# Altium schematic sheet [09] - AFE.SchDoc (part 3 of 3)
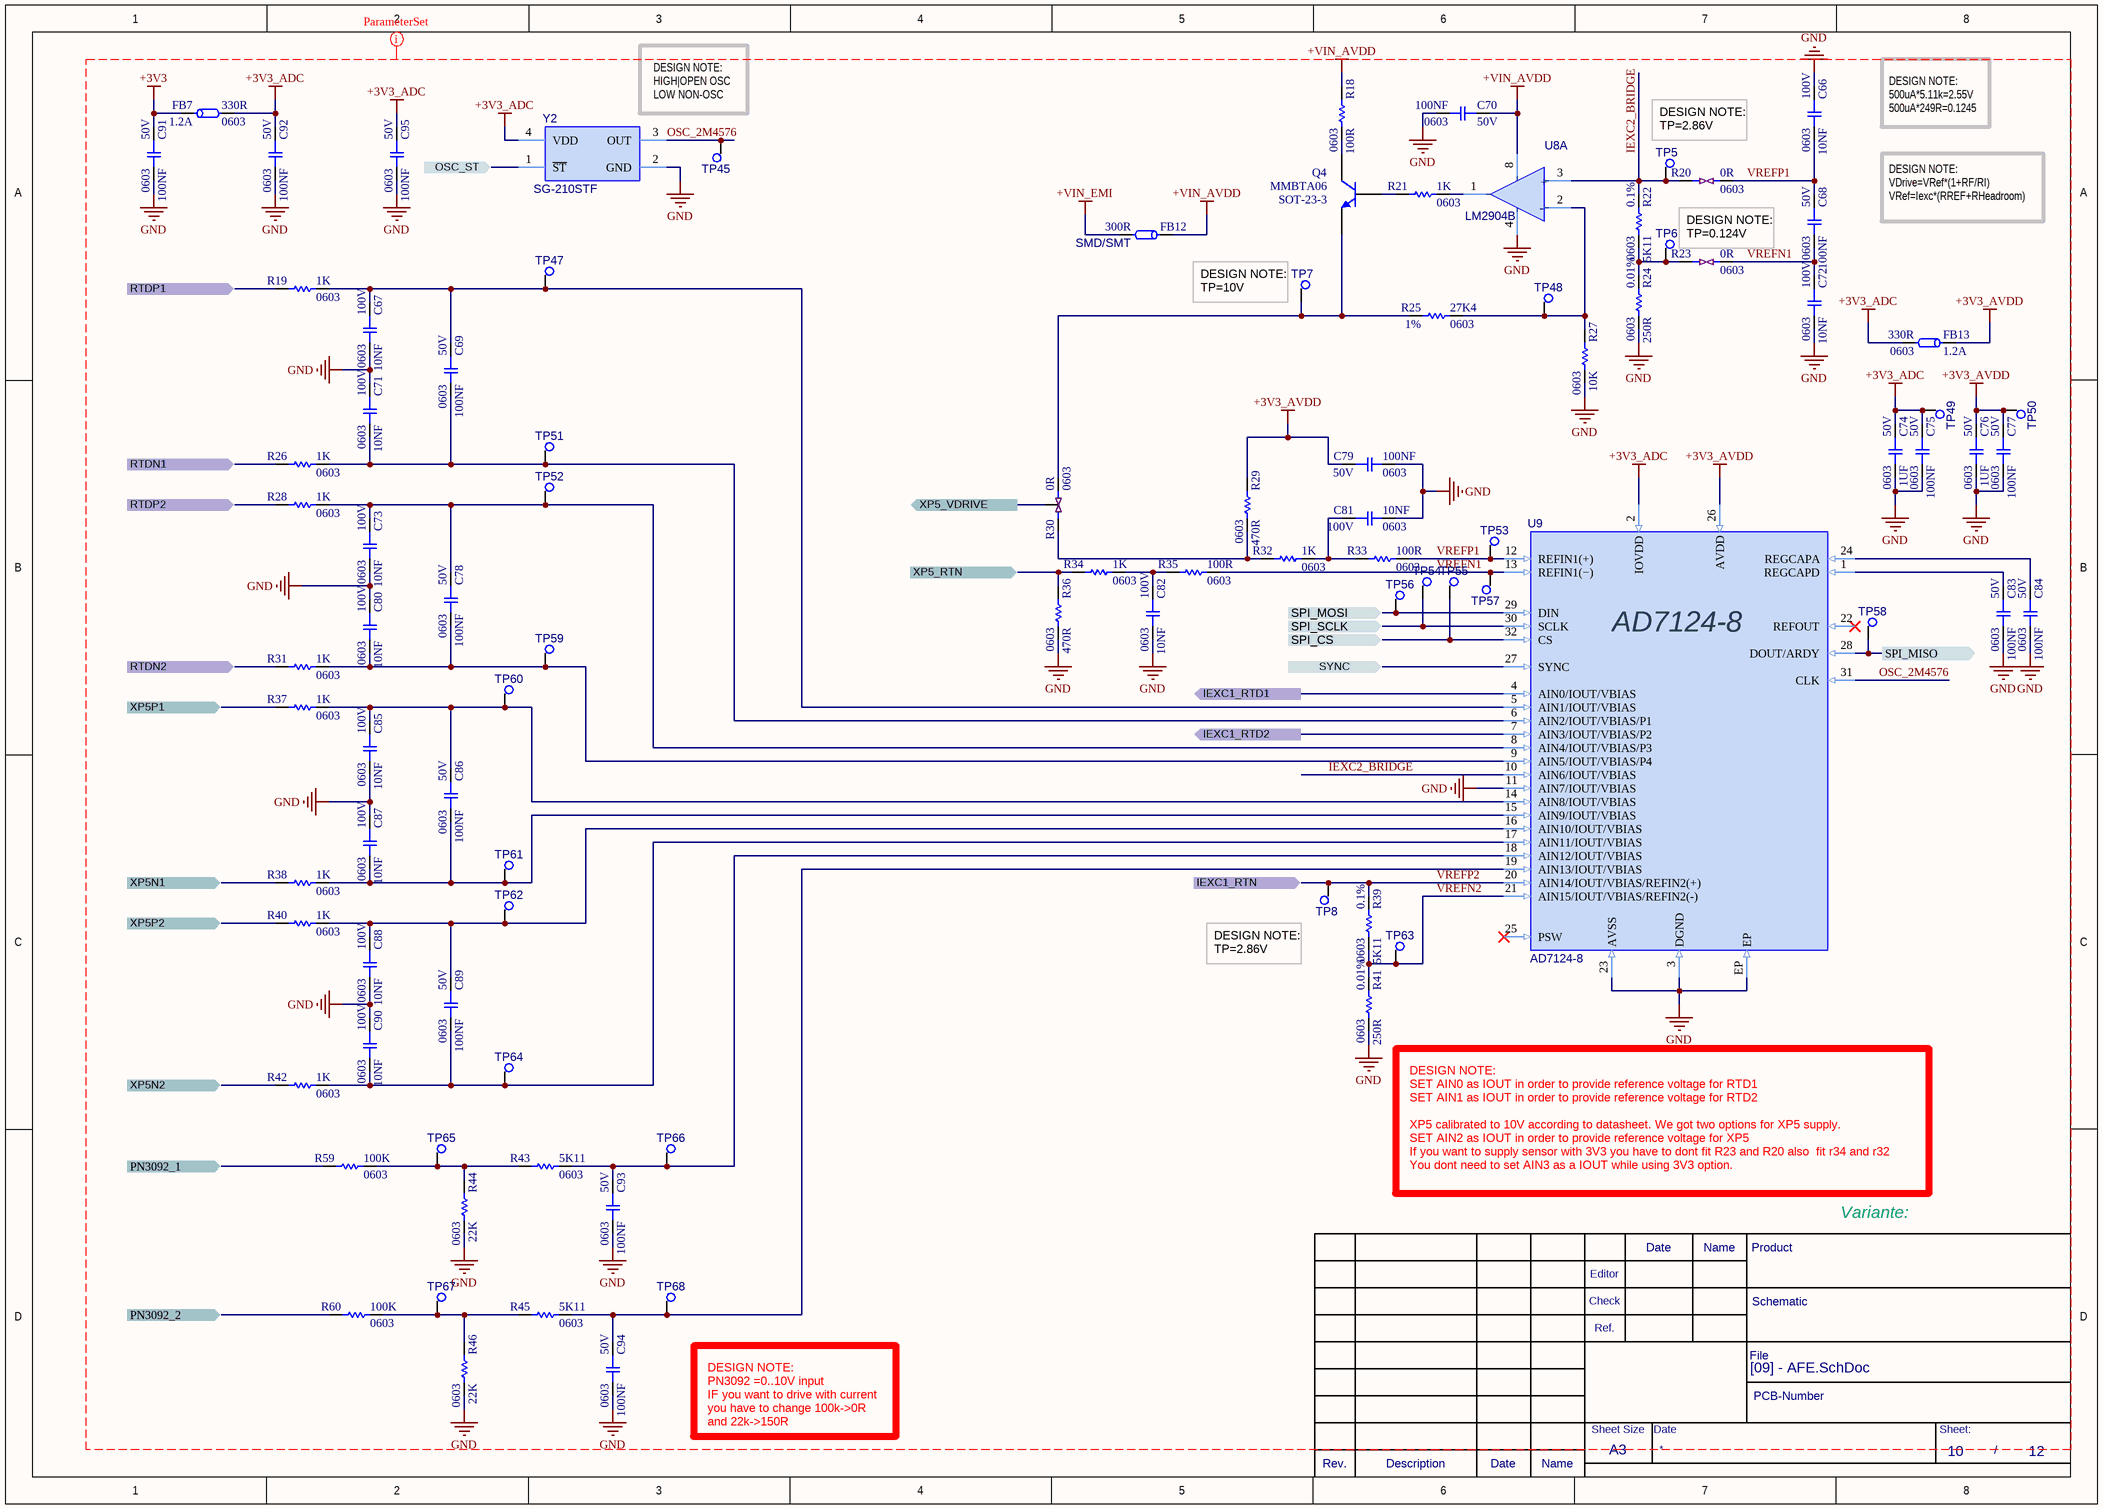
[diagram p2: [09] - AFE.SchDoc]

## Library data of the parts (continued)
R59 R60 = R-100K-0603: RES SMD 100K OHM 5% 1/10W 0603; Manufacturer: YAGEO; Manufacturer Part Number: RC0603JR-10100KL; Resistance: 100kR; Temperature Coefficient: 100ppm/°C; Power Rating: 100mW; Voltage Rating: 50V; Working Voltage: 75V; Number of Resistors: 1; .PCBCHK: USED; .Creator: F:TALI; Washability: OK; Supplier 1: Digi-Key; Supplier Part Number 1: YAG2294DKR-ND; Stock 1: 0; Pricing 1: 1=0.1, 10=0.022, 100=0.0088, 1000=0.00396, 2500=0.00344, 5000=0.00284 (USD); Case/Package: 0603; Number of Pins: 2; Contact Plating: Matte,Tin; Case Code (Metric): 1608; Min Operating Temperature: -55°C; Max Operating Temperature: 155°C; Tolerance: 5%; Composition: Thick Film; Packaging: Tape and Reel; Number of Terminations: 2; Termination: SMD/SMT; Package Quantity: 10000; Military Standard: Not; Max Power Dissipation: 100mW; Voltage Rating (DC): 50V; Features: Moisture Resistant; Length: 1.6mm; Height: 0.022inch; Width: 0.031inch; Depth: 0.8mm; Radiation Hardening: No; REACH SVHC: No SVHC; ComponentLink1URL: http://www.mouser.com/ds/2/447/RC0603-272842.pdf; ComponentLink1Description: http://www.mouser.com/ds/2/447/RC0603-272842.pdf; ComponentLink2URL: https://www.verical.com/server-webapp/html/getDatasheet?partID=326545; ComponentLink2Description: https://www.verical.com/server-webapp/html/getDatasheet?partID=326545; Lead Free: Lead Free; ComponentLink3URL: http://www.farnell.com/datasheets/2167052.pdf; ComponentLink3Description: http://www.farnell.com/datasheets/2167052.pdf; ComponentLink4URL: http://www.farnell.com/datasheets/1868787.pdf; ComponentLink4Description: http://www.farnell.com/datasheets/1868787.pdf; ComponentLink5URL: http://www.farnell.com/datasheets/1738695.pdf; ComponentLink5Description: http://www.farnell.com/datasheets/1738695.pdf; ComponentLink6URL: http://documents.rs-components.com/techlib://itc_doclist_GB.htm?stockno=5048940; ComponentLink6Description: http://documents.rs-components.com/techlib://itc_doclist_GB.htm?stockno=5048940; ComponentLink7URL: http://www.farnell.com/datasheets/443971.pdf; ComponentLink7Description: http://www.farnell.com/datasheets/443971.pdf; Mount: Surface Mount; Weight: 7.1E-05oz; ComponentLink8URL: http://industrial.panasonic.com/www-data/pdf/AOA0000/AOA0000CE2.pdf; ComponentLink8Description: http://industrial.panasonic.com/www-data/pdf/AOA0000/AOA0000CE2.pdf; ComponentLink9URL: https://www.verical.com/server-webapp/html/getDatasheet?partID=247527; ComponentLink9Description: https://www.verical.com/server-webapp/html/getDatasheet?partID=247527; ComponentLink10URL: http://www.alliedelec.com/m/d/623f45ff1957d936ff56d46fd1c28cac.pdf; ComponentLink10Description: http://www.alliedelec.com/m/d/623f45ff1957d936ff56d46fd1c28cac.pdf; ComponentLink11URL: http://www.jameco.com/Jameco/Products/ProdDS/1987476.pdf; ComponentLink11Description: http://www.jameco.com/Jameco/Products/ProdDS/1987476.pdf; Supplier 2: Digi-Key; Supplier Part Number 2: 1276-5110-2-ND; Stock 2: 0; Pricing 2: 5000=0.0033, 10000=0.00287, 25000=0.00252, 50000=0.00231, 125000=0.00229 (USD); ComponentLink12URL: http://www1.futureelectronics.com/doc/SAMSUNG/RCSERIES.pdf; ComponentLink12Description: http://www1.futureelectronics.com/doc/SAMSUNG/RCSERIES.pdf; Failure Rate: 0.01%; ComponentLink13URL: http://www.vishay.com/docs/31010/rcwpm.pdf; ComponentLink13Description: http://www.vishay.com/docs/31010/rcwpm.pdf; ComponentLink14URL: http://www.yageo.com/documents/recent/PYu-RC_Group_51_RoHS_L_9.pdf; ComponentLink14Description: http://www.yageo.com/documents/recent/PYu-RC_Group_51_RoHS_L_9.pdf; ComponentLink15URL: https://www.verical.com/server-webapp/html/getDatasheet?partID=327958; ComponentLink15Description: https://www.verical.com/server-webapp/html/getDatasheet?partID=327958; ComponentLink16URL: http://www.yageo.com/documents/recent/PYu-RC_Group_51_RoHS_L_2.pdf; ComponentLink16Description: http://www.yageo.com/documents/recent/PYu-RC_Group_51_RoHS_L_2.pdf; ComponentLink17URL: http://www.yageo.com/NewPortal/yageodocoutput?fileName=/pdf/R-Chip/PYu-RT_1-to-0.05_RoHS_L_5.pdf; ComponentLink17Description: http://www.yageo.com/NewPortal/yageodocoutput?fileName=/pdf/R-Chip/PYu-RT_1-to-0.05_RoHS_L_5.pdf; Lead Pitch: 0.4mm; ComponentLink18URL: http://documents.rs-components.com/techlib://itc_doclist_GB.htm?stockno=6185113; ComponentLink18Description: http://documents.rs-components.com/techlib://itc_doclist_GB.htm?stockno=6185113; ComponentLink19URL: http://www.yageo.ru/pdf/RC0805.pdf; ComponentLink19Description: http://www.yageo.ru/pdf/RC0805.pdf; ComponentLink20URL: http://www.farnell.com/datasheets/38627.pdf; ComponentLink20Description: http://www.farnell.com/datasheets/38627.pdf; ComponentLink21URL: http://www.farnell.com/datasheets/1697719.pdf; ComponentLink21Description: http://www.farnell.com/datasheets/1697719.pdf; ComponentLink22URL: http://www.farnell.com/datasheets/1686128.pdf; ComponentLink22Description: http://www.farnell.com/datasheets/1686128.pdf; ComponentLink23URL: http://www.farnell.com/datasheets/444164.pdf; ComponentLink23Description: http://www.farnell.com/datasheets/444164.pdf; Supplier 3: Digi-Key; Supplier Part Number 3: A106046DKR-ND; Stock 3: 219997; Pricing 3: 1=0.1, 10=0.026, 100=0.0104, 1000=0.00469, 2500=0.00407 (USD); ELV: Compliant; ComponentLink24URL: http://www.alliedelec.com/m/d/dd92310293d361ca5b4f9a8a31ebf2ac.pdf; ComponentLink24Description: http://www.alliedelec.com/m/d/dd92310293d361ca5b4f9a8a31ebf2ac.pdf; ComponentLink25URL: http://www.mouser.com/ds/2/418/NG_CD_1622827_BA-655491.pdf; ComponentLink25Description: http://www.mouser.com/ds/2/418/NG_CD_1622827_BA-655491.pdf; ComponentLink26URL: http://uk.rs-online.com/webdocs/13d1/0900766b813d116f.pdf; ComponentLink26Description: http://uk.rs-online.com/webdocs/13d1/0900766b813d116f.pdf; Supplier 4: Digi-Key; Supplier Part Number 4: P100KHCT-ND; Stock 4: 9351077; Pricing 4: 1=0.1, 10=0.065, 100=0.0264, 1000=0.01186, 2500=0.01029 (USD); Supplier 5: Digi-Key; Supplier Part Number 5: P20200DKR-ND; Stock 5: 0; Pricing 5: 1=0.25, 10=0.211, 25=0.1532, 50=0.111, 100=0.0823, 250=0.06316, 500=0.04976, 1000=0.03445 (USD); Height - Seated (Max): 0.022inch; Supplier 6: Digi-Key; Supplier Part Number 6: RMCF0603JT100KDKR-ND; Stock 6: 227219; Pricing 6: 1=0.1, 10=0.016, 100=0.0064, 1000=0.00289, 2500=0.0025 (USD); ComponentLink27URL: https://www.verical.com/server-webapp/html/getDatasheet?partID=359906; ComponentLink27Description: https://www.verical.com/server-webapp/html/getDatasheet?partID=359906; Supplier Part Number 7: SMD0603-100K; Stock 7: 0; ComponentLink28URL: http://datasheet.octopart.com/0603SAJ0104T5E-Royal-Ohm-datasheet-17591902.pdf; ComponentLink28Description: http://datasheet.octopart.com/0603SAJ0104T5E-Royal-Ohm-datasheet-17591902.pdf; ComponentLink29URL: http://datasheet.octopart.com/0603SAJ0104T5E-Royal-Ohm-datasheet-62069544.pdf; ComponentLink29Description: http://datasheet.octopart.com/0603SAJ0104T5E-Royal-Ohm-datasheet-62069544.pdf; ComponentLink30URL: http://datasheet.octopart.com/0603SAJ0104T5E-Royal-Electronics-datasheet-17591902.pdf; ComponentLink30Description: http://datasheet.octopart.com/0603SAJ0104T5E-Royal-Electronics-datasheet-17591902.pdf; Supplier 7: Ozdisan; Supplier 8: Digi-Key; Supplier Part Number 8: 1276-5110-6-ND; Stock 8: 1000; Pricing 8: 1=0.1, 10=0.028, 100=0.0113, 1000=0.00507, 2500=0.0044 (USD); .SCHCHK: USED
TP5-TP8 TP45 TP47-TP68 = MECH-TESTPOINT: .PCBCHK: USED; .Creator: F:TALI; Washability: OK; .SCHCHK: USED
U8 = IC-LM2904BQDRQ1: IC OPAMP GP 2 CIRCUIT 8SOIC; Manufacturer: Texas Instruments; Supplier 1: Digi-Key; Supplier Part Number 1: 296-LM2904BQDRQ1CT-ND; Manufacturer Part Number: LM2904BQDRQ1; Stock: 1587; Pricing: 1=0.44, 10=0.375, 25=0.35, 100=0.26, 250=0.22, 500=0.21, 1000=0.155 (USD); RoHS: No; ComponentLink1Description: datasheet; ComponentLink1URL: https://www.ti.com/lit/ds/symlink/lm2904-q1.pdf?HQS=TI-null-null-digikeymode-df-pf-null-wwe&ts=1602145041041
U9 = IC-AD7124-8BCPZ-RL7: IC ADC 24BIT SIGMA-DELTA 32LFCSP; Manufacturer: Analog Devices; Number of Bits: 24; Sampling Rate: 19.2KS/s; Interface: SPI; Number of A/D Converters: 1; Resolution: 24b; Min Supply Voltage: 2.7V; Max Supply Voltage: 3.6V; Dual Supply Voltage: 1.8V; Polarity: Bipolar,Unipolar; Supply Type: Analog,Digital; Input Capacitance: 5.5pF; Common Mode Rejection Ratio: 76dB; Quiescent Current: 2.8mA; Operating Supply Current: 5.6mA; Power Supply Rejection Ratio (PSRR): 95dB; Settling Time: 1us; Slew Rate: 20V/µs; Input Offset Voltage (Vos): 1mV; ComponentLink1URL: http://www.mouser.com/ds/2/609/AD7124-8-586740.pdf?src-supplier=Mouser; ComponentLink1Description: http://www.mouser.com/ds/2/609/AD7124-8-586740.pdf?src-supplier=Mouser; ComponentLink2URL: http://www.analog.com/media/en/technical-documentation/data-sheets/AD7124-8.pdf?src-supplier=Digi-Key; ComponentLink2Description: http://www.analog.com/media/en/technical-documentation/data-sheets/AD7124-8.pdf?src-supplier=Digi-Key; ComponentLink3URL: http://www.analog.com/media/en/technical-documentation/data-sheets/AD7124-8.pdf?src-supplier=Avnet; ComponentLink3Description: http://www.analog.com/media/en/technical-documentation/data-sheets/AD7124-8.pdf?src-supplier=Avnet; ComponentLink4URL: https://www.analog.com/media/en/technical-documentation/data-sheets/ad7124-8.pdf?src-supplier=Digi-Key; ComponentLink4Description: https://www.analog.com/media/en/technical-documentation/data-sheets/ad7124-8.pdf?src-supplier=Digi-Key; Supplier 1: Digi-Key; Supplier Part Number 1: AD7124-8BCPZ-ND; Manufacturer Part Number: AD7124-8BCPZ; Stock: 2540; Pricing: 1=11.73, 10=10.6, 25=10.1064, 100=8.381, 250=7.6415, 500=7.1485 (USD); RoHS: Yes; Mount: Surface Mount; Number of Pins: 32; Min Operating Temperature: -55°C; Max Operating Temperature: 125°C; Packaging: Tray; Length: 5.1mm; Height: 0.75mm; Width: 5.1mm; REACH SVHC: No SVHC; Lead Free: Contains Lead; ComponentLink5URL: http://www.farnell.com/datasheets/2251043.pdf?src-supplier=Farnell; ComponentLink5Description: http://www.farnell.com/datasheets/2251043.pdf?src-supplier=Farnell; ComponentLink6URL: http://www.farnell.com/datasheets/2081834.pdf?src-supplier=Element14; ComponentLink6Description: http://www.farnell.com/datasheets/2081834.pdf?src-supplier=Element14
Y2 = OSC-SG-210STF 2.4576ML: XTAL OSC XO 2.4576MHZ CMOS SMD; Manufacturer: Epson; Max Supply Current: 1.8mA; Frequency Stability: 50ppm; Supplier 1: Digi-Key; Supplier Part Number 1: SER3866-ND; Manufacturer Part Number: SG-210STF 2.4576ML; Stock: 214; Pricing: 1=1.22, 10=1.081, 50=1.0106, 100=0.893 (USD); RoHS: Yes; Mount: Surface Mount; Case/Package: SMD/SMT; Min Operating Temperature: -40°C; Max Operating Temperature: 85°C; Frequency: 2.4576MHz; Packaging: Cut Strip; Length: 0.098inch; Height: 0.035inch; Width: 0.079inch; ComponentLink1URL: https://datasheet.ciiva.com/29629/029-sg-210stf-e147-29629205.pdf?src-supplier=Digi-Key; ComponentLink1Description: https://datasheet.ciiva.com/29629/029-sg-210stf-e147-29629205.pdf?src-supplier=Digi-Key